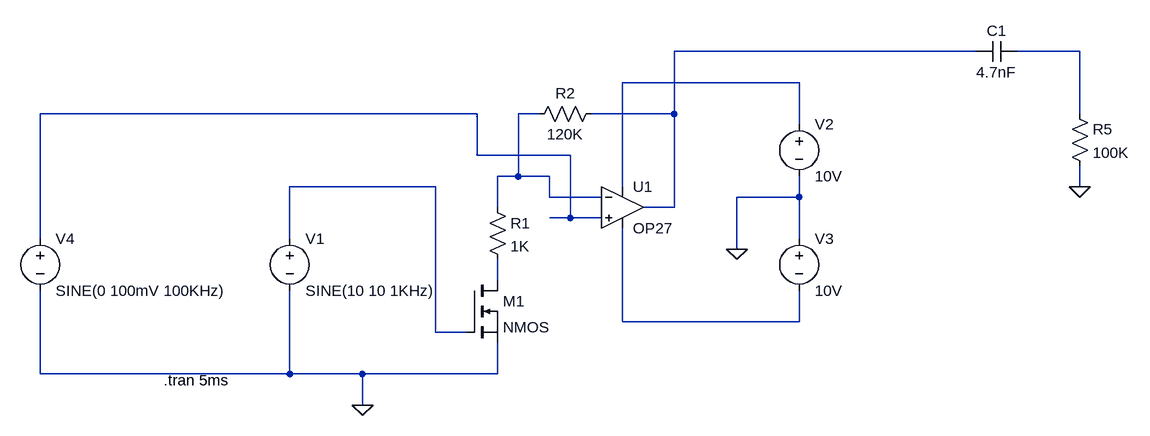
[diagram p0: schematic vca.asc]
vca.asc, the LTspice schematic file:
Version 4
SHEET 1 1364 680
WIRE 784 -80 320 -80
WIRE 944 -80 848 -80
WIRE 512 -32 240 -32
WIRE 16 16 -656 16
WIRE 112 16 80 16
WIRE 320 16 320 -80
WIRE 320 16 192 16
WIRE 944 16 944 -80
WIRE 512 32 512 -32
WIRE 16 80 16 16
WIRE 160 80 16 80
WIRE 80 112 80 16
WIRE 80 112 48 112
WIRE 128 112 80 112
WIRE -48 128 -272 128
WIRE 240 128 240 -32
WIRE 944 128 944 96
WIRE 128 144 128 112
WIRE 208 144 128 144
WIRE 512 144 512 112
WIRE 512 144 416 144
WIRE 48 160 48 112
WIRE 320 160 320 16
WIRE 320 160 272 160
WIRE 160 176 160 80
WIRE 160 176 128 176
WIRE 208 176 160 176
WIRE -656 208 -656 16
WIRE -272 208 -272 128
WIRE 512 208 512 144
WIRE 416 224 416 144
WIRE 48 272 48 240
WIRE 240 336 240 192
WIRE 512 336 512 288
WIRE 512 336 240 336
WIRE -48 352 -48 128
WIRE 0 352 -48 352
WIRE -656 416 -656 288
WIRE -272 416 -272 288
WIRE -272 416 -656 416
WIRE -160 416 -272 416
WIRE 48 416 48 368
WIRE 48 416 -160 416
WIRE -160 464 -160 416
FLAG 416 224 0
FLAG -160 464 0
FLAG 944 128 0
SYMBOL voltage 512 16 R0
WINDOW 123 0 0 Left 2
WINDOW 39 0 0 Left 2
SYMATTR InstName V2
SYMATTR Value 10V
SYMBOL voltage 512 192 R0
WINDOW 123 0 0 Left 2
WINDOW 39 0 0 Left 2
SYMATTR InstName V3
SYMATTR Value 10V
SYMBOL voltage -272 192 R0
WINDOW 123 0 0 Left 2
WINDOW 39 0 0 Left 2
SYMATTR InstName V1
SYMATTR Value SINE(10 10 1KHz)
SYMBOL res 32 144 R0
SYMATTR InstName R1
SYMATTR Value 1K
SYMBOL res 208 0 R90
WINDOW 0 0 56 VBottom 2
WINDOW 3 32 56 VTop 2
SYMATTR InstName R2
SYMATTR Value 120K
SYMBOL voltage -656 192 R0
WINDOW 123 0 0 Left 2
WINDOW 39 0 0 Left 2
SYMATTR InstName V4
SYMATTR Value SINE(0 100mV 100KHz)
SYMBOL res 928 0 R0
SYMATTR InstName R5
SYMATTR Value 100K
SYMBOL cap 848 -96 R90
WINDOW 0 0 32 VBottom 2
WINDOW 3 32 32 VTop 2
SYMATTR InstName C1
SYMATTR Value 4.7nF
SYMBOL Opamps\\OP27 240 96 R0
SYMATTR InstName U1
SYMBOL nmos 0 272 R0
SYMATTR InstName M1
TEXT -466 426 Left 2 !.tran 5ms

The netlist it stands for:
* vca.asc
V2 N003 0 10V
V3 0 N008 10V
V1 N006 0 SINE(10 10 1KHz)
R1 N005 N007 1K
R2 N001 N005 120K
V4 N004 0 SINE(0 100mV 100KHz)
R5 N002 0 100K
C1 N002 N001 4.7nF
XU1 N004 N005 N003 N008 N001 OP27  ; pins In+ In- V+ V- OUT
M1 N007 N006 0 0 NMOS
.model NMOS NMOS
.model PMOS PMOS
.lib standard.mos
.tran 5ms
.lib ADI.lib
.backanno
.end